# Altium schematic sheet Transceivers.SchDoc
size A3; Organization: Altium Limited; Address1: L3, 12a Rodborough Rd; Address2: Frenchs Forest; Address3: NSW; Address4: Australia 2086
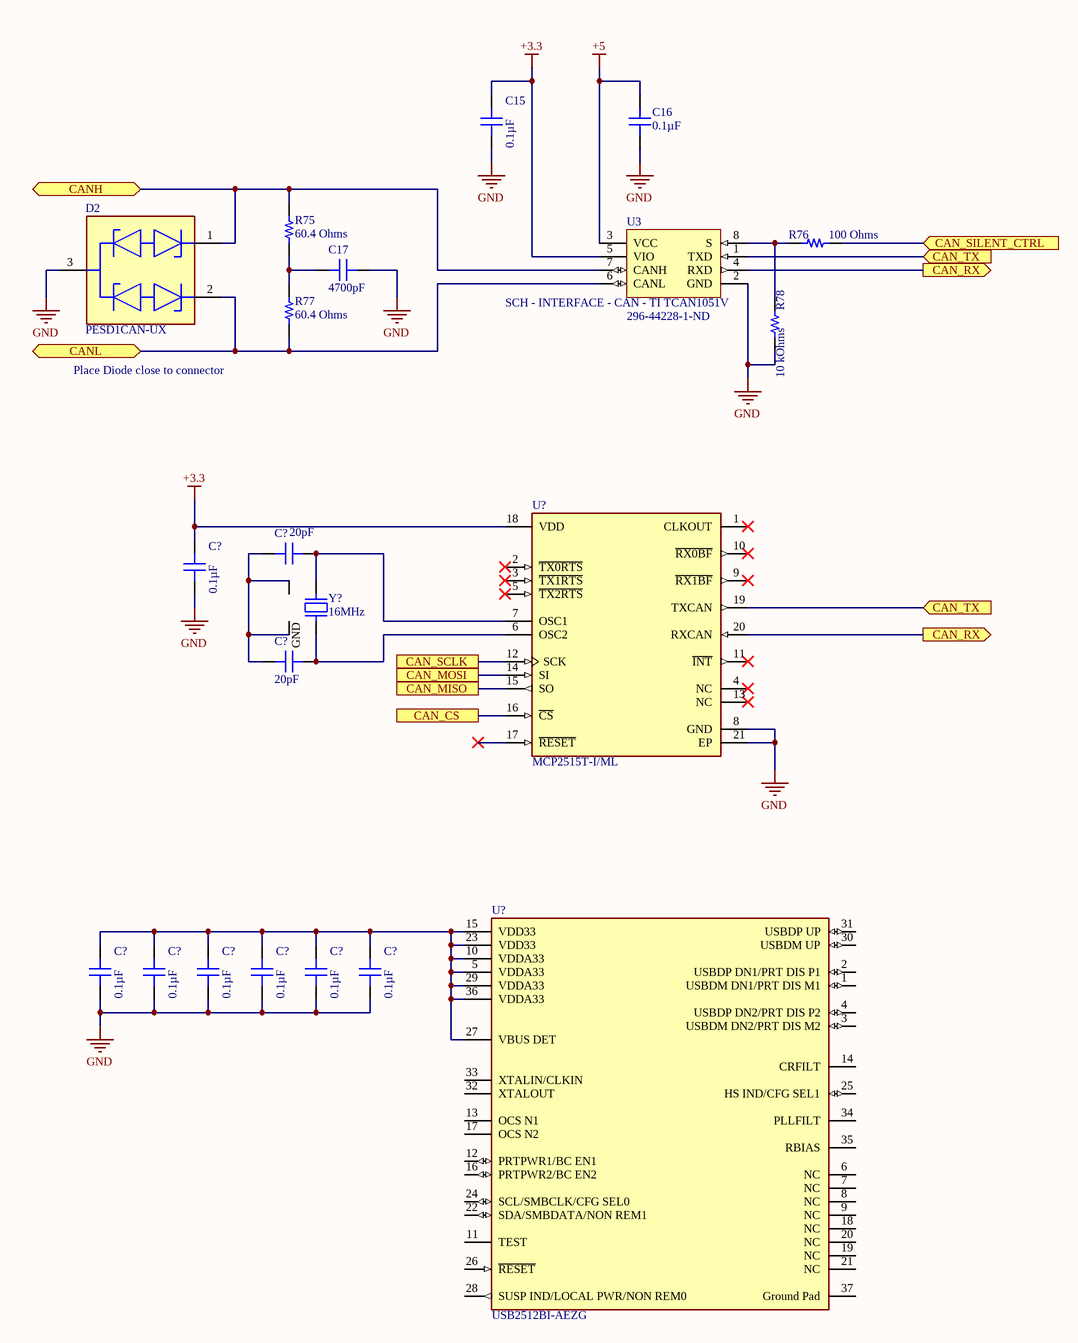
[diagram p0: Transceivers.SchDoc]

## Parts
(Parts that share a designator on the sheet are numbered #1, #2 ... from top to bottom, then left to right.)
C15  0.1µF  [CAP 0603_1608]
C16  0.1µF  [CAP 0603_1608]
C17  4700pF  [CAP 0603_1608]
C?#1  20pF  [CAP 0603_1608]
C?#2  0.1µF  [CAP 0603_1608]
C?#3  20pF  [CAP 0603_1608]
C?#4  0.1µF  [CAP 0603_1608]
C?#5  0.1µF  [CAP 0603_1608]
C?#6  0.1µF  [CAP 0603_1608]
C?#7  0.1µF  [CAP 0603_1608]
C?#8  0.1µF  [CAP 0603_1608]
C?#9  0.1µF  [CAP 0603_1608]
D2  PESD1CAN-UX  [FP-SOT323-MFG]
R75  60.4 Ohms  [RES 1206_3216]
R76  100 Ohms  [RES 0603_1608]
R77  60.4 Ohms  [RES 1206_3216]
R78  10 kOhms  [RES 0603_1608]
U3  SCH - INTERFACE - CAN - TI TCAN1051V  Supplier Part Number 1: 296-44228-1-ND  [PCB - LEADS - SOIC - TI SOIC-8]
U?#1  MCP2515T-I/ML  [FP-C04-126-MFG]
U?#2  USB2512BI-AEZG  [FP-USB2512BI-AEZG-MFG]
Y?  16MHz  [EPSON TSX-3225]

## Ports
CAN_CS, CAN_MISO, CAN_MOSI, CAN_RX (out), CAN_SCLK, CAN_SILENT_CTRL (in), CAN_TX (in), CANH (bidir), CANL (bidir)

## Nets
+3.3: C15.2 C?#2.2 U3.5(VIO) U?#1.18(VDD)
+5: C16.2 U3.3(VCC)
GND: C15.1 C16.1 C17.2 C?#2.1 C?#4.1 C?#5.1 C?#6.1 C?#7.1 C?#8.1 C?#9.1 D2.3(common_cathode) R78.1 U3.2(GND) U?#1.8(GND) U?#1.21(EP)
CAN_CS: U?#1.16(~{CS}) ; port CAN_CS
CAN_MISO: U?#1.15(SO) ; port CAN_MISO
CAN_MOSI: U?#1.14(SI) ; port CAN_MOSI
CAN_RX: U3.4(RXD) U?#1.20(RXCAN) ; port CAN_RX
CAN_SCLK: U?#1.12(SCK) ; port CAN_SCLK
CAN_SILENT_CTRL: R76.2 ; port CAN_SILENT_CTRL
CAN_TX: U3.1(TXD) U?#1.19(TXCAN) ; port CAN_TX
CANH: D2.1(cathode_1) R75.2 U3.7(CANH) ; port CANH
CANL: D2.2(cathode_2) R77.1 U3.6(CANL) ; port CANL
NetC17_1: C17.1 R75.1 R77.2
NetC?#1_1: C?#1.1 C?#3.1 Y?.2(GND) Y?.4(GND)
NetC?#1_2: C?#1.2 U?#1.7(OSC1) Y?.3
NetC?#3_2: C?#3.2 U?#1.6(OSC2) Y?.1
NetC?#4_2: C?#4.2 C?#5.2 C?#6.2 C?#7.2 C?#8.2 C?#9.2 U?#2.5(VDDA33) U?#2.10(VDDA33) U?#2.15(VDD33) U?#2.23(VDD33) U?#2.27(VBUS_DET) U?#2.29(VDDA33) U?#2.36(VDDA33)
NetR76_1: R76.1 R78.2 U3.8(S)

Not connected (* = marked no-connect by the designer): U?#1 1(CLKOUT)* 2(~{TX0RTS})* 3(~{TX1RTS})* 4(NC)* 5(~{TX2RTS})* 9(~{RX1BF})* 10(~{RX0BF})* 11(~{INT})* 13(NC)* 17(~{RESET})*; U?#2 1(USBDM_DN1/PRT_DIS_M1) 2(USBDP_DN1/PRT_DIS_P1) 3(USBDM_DN2/PRT_DIS_M2) 4(USBDP_DN2/PRT_DIS_P2) 6(NC) 7(NC) 8(NC) 9(NC) 11(TEST) 12(PRTPWR1/BC_EN1) 13(OCS_N1) 14(CRFILT) 16(PRTPWR2/BC_EN2) 17(OCS_N2) 18(NC) 19(NC) 20(NC) 21(NC) 22(SDA/SMBDATA/NON_REM1) 24(SCL/SMBCLK/CFG_SEL0) 25(HS_IND/CFG_SEL1) 26(~{RESET}) 28(SUSP_IND/LOCAL_PWR/NON_REM0) 30(USBDM_UP) 31(USBDP_UP) 32(XTALOUT) 33(XTALIN/CLKIN) 34(PLLFILT) 35(RBIAS) 37(Ground_Pad)

## Notes on the sheet
- Place Diode close to connector
- Title
- Size:
- Date:
- A3
- Number:
- Time:
- Revision:
- Sheet
- of
- File:

## Library data of the parts
C15 C16 C?#2 C?#4-C?#9 = CL10B104KA8WPNC: CAP CER 0.1UF 25V X7R 0603; Manufacturer: Samsung Electro-Mechanics; Tolerance: ±10%; Part Number: CL10B104KA8WPNC; Value: 0.1µF; Applications: Automotive; Capacitance: 0.1µF; ComponentLink1Description: Datasheet; ComponentLink1URL: http://www.samsungsem.com/kr/support/product-search/mlcc/CL10B104KA8WPNC.jsp; ComponentLink2Description: DigiKey Link; ComponentLink2URL: http://digikey.com/product-detail/en/samsung-electro-mechanics/CL10B104KA8WPNC/1276-6717-1-ND/5961576; Device Package: 0603 (1608 Metric); Features: Open Mode; LastUpdated: 9/2/2020 1:03:30 AM; Lifecycle Status: Active; Minimum Order: 1; Mounting Type: Surface Mount, MLCC; Operating Temperature: -55°C ~ 125°C; Package / Case: 0603 (1608 Metric); Packaging: TapeAndReel; PartId: 5631; Part Status: Active; Price: 0.02; Ratings: AEC-Q200; Series: CL; Size / Dimension: 0.063" L x 0.031" W (1.60mm x 0.80mm); Supplier 1: DigiKey; Supplier Part Number 1: 1276-6717-1-ND; Temperature Coefficient: X7R; Thickness (Max): 0.035" (0.90mm); Voltage - Rated: 25V
C17 = VJ0603Y472KXACW1BC: CAP CER 4700PF 50V X7R 0603; Manufacturer: Vishay Vitramon; Tolerance: ±10%; Part Number: VJ0603Y472KXACW1BC; Value: 4700pF; Applications: General Purpose; Capacitance: 4700pF; ComponentLink1Description: Datasheet; ComponentLink1URL: https://www.vishay.com/docs/28548/vjw1bcbascomseries.pdf; ComponentLink2Description: DigiKey Link; ComponentLink2URL: http://digikey.com/product-detail/en/vishay-vitramon/VJ0603Y472KXACW1BC/720-1530-1-ND/421007; Device Package: 0603 (1608 Metric); LastUpdated: 9/2/2020 1:03:13 AM; Lifecycle Status: Active; Minimum Order: 1; Mounting Type: Surface Mount, MLCC; Operating Temperature: -55°C ~ 125°C; Package / Case: 0603 (1608 Metric); Packaging: TapeAndReel; PartId: 14247; Part Status: Active; Price: 0.01; Series: VJ; Size / Dimension: 0.063" L x 0.031" W (1.60mm x 0.80mm); Supplier 1: DigiKey; Supplier Part Number 1: 720-1530-1-ND; Temperature Coefficient: X7R; Thickness (Max): 0.035" (0.90mm); Voltage - Rated: 50V
C?#1 C?#3 = CML0603C0G200JT50V: CAP CER 20PF 50V C0G/NP0 0603; Manufacturer: Stackpole Electronics Inc; Temperature Coefficient: C0G, NP0; Tolerance: ±5%; Part Number: CML0603C0G200JT50V; Value: 20pF; Applications: General Purpose; Capacitance: 20pF; ComponentLink1Description: Datasheet; ComponentLink1URL: http://www.seielect.com/Catalog/SEI-CML.PDF; ComponentLink2Description: DigiKey Link; ComponentLink2URL: http://digikey.com/product-detail/en/stackpole-electronics-inc/CML0603C0G200JT50V/738-CML0603C0G200JT50VCT-ND/10660186; Device Package: 0603 (1608 Metric); LastUpdated: 9/2/2020 1:03:28 AM; Lifecycle Status: Active; Minimum Order: 1; Mounting Type: Surface Mount, MLCC; Operating Temperature: -55°C ~ 125°C; Package / Case: 0603 (1608 Metric); Packaging: Unknown; PartId: 26340; Part Status: Active; Price: 0.01; Series: CML_C0G; Supplier 1: DigiKey; Supplier Part Number 1: 738-CML0603C0G200JT50VCT-ND; Voltage - Rated: 50V
D2 = CMP-14436-000006-1: TVS DIODE 24V 50V SC70-3
R75 R77 = ESR18EZPF60R4: RES SMD 60.4 OHM 1% 1/2W 1206; Manufacturer: Rohm Semiconductor; Power (Watts): 0.5W, 1/2W; Temperature Coefficient: ±100ppm/°C; Part Number: ESR18EZPF60R4; ComponentLink1Description: Datasheet; ComponentLink1URL: https://www.rohm.com/datasheet/ESR01MZPF/esr-e; ComponentLink2Description: DigiKey Link; ComponentLink2URL: http://digikey.com/product-detail/en/rohm-semiconductor/ESR18EZPF60R4/RHM60.4AFCT-ND/1983938; Composition: Thick Film; Device Package: 1206 (3216 Metric); Features: Automotive AEC-Q200, Pulse Withstanding; Height - Seated (Max): 0.026" (0.65mm); LastUpdated: 9/2/2020 1:12:41 AM; Lifecycle Status: Active; Minimum Order: 1; Number of Terminations: 2; Operating Temperature: -55°C ~ 155°C; Package / Case: 1206 (3216 Metric); Packaging: TapeAndReel; PartId: 38901; Part Status: Active; Price: 0.02; Ratings: AEC-Q200; Resistance: 60.4 Ohms; Series: ESR; Size / Dimension: 0.126" L x 0.063" W (3.20mm x 1.60mm); Supplier 1: DigiKey; Supplier Part Number 1: RHM60.4AFCT-ND; Supplier Device Package: 1206; Tolerance: ±1%; Value: 60.4 Ohms
R76 = RMCF0603FG100R: RES 100 OHM 1% 1/10W 0603; Manufacturer: Stackpole Electronics Inc; Power (Watts): 0.1W, 1/10W; Temperature Coefficient: ±100ppm/°C; Part Number: RMCF0603FG100R; Value: 100 Ohms; ComponentLink1Description: Datasheet; ComponentLink1URL: https://www.seielect.com/catalog/sei-rmcf_rmcp.pdf; ComponentLink2Description: DigiKey Link; ComponentLink2URL: http://digikey.com/product-detail/en/stackpole-electronics-inc/RMCF0603FG100R/RMCF0603FG100RCT-ND/4425033; Composition: Thick Film; Device Package: 0603 (1608 Metric); Features: Automotive AEC-Q200; Height - Seated (Max): 0.022" (0.55mm); LastUpdated: 9/2/2020 1:09:39 AM; Lifecycle Status: Active; Minimum Order: 1; Number of Terminations: 2; Operating Temperature: -55°C ~ 155°C; Package / Case: 0603 (1608 Metric); Packaging: CutTape; PartId: 24036; Part Status: Active; Price: 0.10; Ratings: AEC-Q200; Resistance: 100 Ohms; Series: RMCF; Size / Dimension: 0.061" L x 0.031" W (1.55mm x 0.80mm); Supplier 1: DigiKey; Supplier Part Number 1: RMCF0603FG100RCT-ND; Supplier Device Package: 0603; Tolerance: ±1%
R78 = RMCF0603JT10K0: RES 10K OHM 5% 1/10W 0603; Manufacturer: Stackpole Electronics Inc; Power (Watts): 0.1W, 1/10W; Temperature Coefficient: ±200ppm/°C; Part Number: RMCF0603JT10K0; Value: 10 kOhms; ComponentLink1Description: Datasheet; ComponentLink1URL: https://www.seielect.com/catalog/sei-packaging.pdf; ComponentLink2Description: DigiKey Link; ComponentLink2URL: http://digikey.com/product-detail/en/stackpole-electronics-inc/RMCF0603JT10K0/RMCF0603JT10K0CT-ND/1943191; Composition: Thick Film; Device Package: 0603 (1608 Metric); Features: Automotive AEC-Q200; Height - Seated (Max): 0.022" (0.55mm); LastUpdated: 8/30/2020 8:48:45 PM; Lifecycle Status: Active; Minimum Order: 1; Number of Terminations: 2; Operating Temperature: -55°C ~ 155°C; Package / Case: 0603 (1608 Metric); Packaging: CutTape; PartId: 25659; Part Status: Active; Price: 0.10; Ratings: AEC-Q200; Resistance: 10 kOhms; Series: RMCF; Size / Dimension: 0.061" L x 0.031" W (1.55mm x 0.80mm); Supplier 1: DigiKey; Supplier Part Number 1: RMCF0603JT10K0CT-ND; Supplier Device Package: 0603; Tolerance: ±5%
U?#1 = CMP-0186-00186-2: IC CAN CTLR W/SPI 2.0B 20-QFN; Max Supply Voltage: 5.5V; Max Supply Current: 10mA; Number of Transceivers: 1; Min Supply Voltage: 2.7V; Data Rate: 1000Kbps; Interface: SPI; Mount: Surface Mount; Packaging: Tape and Reel; Lead Free: Lead Free; Package Quantity: 3300; Case/Package: QFN; Max Operating Temperature: 85°C; Number of Pins: 20; Min Operating Temperature: -40°C; Contact Plating: Tin; Radiation Hardening: No; Nominal Supply Current: 10mA
U?#2 = CMP-06284-000006-1: IC USB 2.0 2PORT HUB CTLR 36QFN; Manufacturer: Microchip Technology; Interface: I2C,USB,SMBus; Max Supply Voltage: 3.6V; Standoff Height: 0mm; Number Of Ports: 2; Description: USB Hub Controller USB 2.0 USB Interface 36-QFN (6x6); Usb Standard: USB 2.0; Min Supply Voltage: 3V; Automotive: No; Temperature: -40°C to +85°C; Ambient Temperature Range Low: -40°C; Lead Free: Yes; RoHS: TRUE; Height: 1mm; Category: IC; ComponentLink2Description: Datasheet; Device Class L1: Integrated Circuits (ICs); Octopart: https://octopart.com/usb2512bi-aezg-microchip-24995415; Device Class L3: USB Interface ICs; Manufacturer Part Number: USB2512BI-AEZG; ComponentLink2URL: http://ww1.microchip.com/downloads/en/DeviceDoc/00001692C.pdf; Ipc Land Pattern Name: QFN50P600X600X90-36; Temperature Range Low: -40°C; Mouser Description: USB Interface IC USB2.0 HIGH SPEED IND HUB CONTROLLER; Ambient Temperature Range High: +85°C; Digikey Description: IC USB 2.0 2PORT HUB CTLR 36QFN; Temperature Range High: +85°C; Package: 0; Device Class L2: Interface ICs
Y? = TSX-3225 16.0000MF10U-B0: CRYSTAL 16.00 MHZ 16.0PF SMD; Manufacturer: EPSON; ESR (Equivalent Series Resistance): 60 Ohms; Frequency Stability: ±10ppm; Load Capacitance: 16pF; Operating Mode: Fundamental; Part Number: TSX-3225 16.0000MF10U-B0; ComponentLink1Description: Datasheet; ComponentLink1URL: https://support.epson.biz/td/api/doc_check.php?dl=brief_TSX-3225&lang=en; ComponentLink2Description: DigiKey Link; ComponentLink2URL: http://digikey.com/product-detail/en/epson/TSX-3225-16.0000MF10U-B0/SER4370CT-ND/7932354; Frequency: 16MHz; Frequency Tolerance: ±10ppm; Height - Seated (Max): 0.024" (0.60mm); LastUpdated: 9/2/2020 1:21:55 AM; Lifecycle Status: Active; Minimum Order: 1; Mounting Type: Surface Mount; Operating Temperature: -10°C ~ 60°C; Package / Case: 4-SMD, No Lead; Packaging: TapeAndReel; PartId: 436; Part Status: Active; Price: 0.18; Series: TSX-3225; Size / Dimension: 0.126" L x 0.098" W (3.20mm x 2.50mm); Supplier 1: DigiKey; Supplier Part Number 1: SER4370CT-ND; Type: MHz Crystal; Value: 16MHz
U3 = SCH - INTERFACE - CAN - TI TCAN1051V: Supplier 1: Digi-Key